# EAGLE design LightingBoard2 (EAGLE 8.5.2)
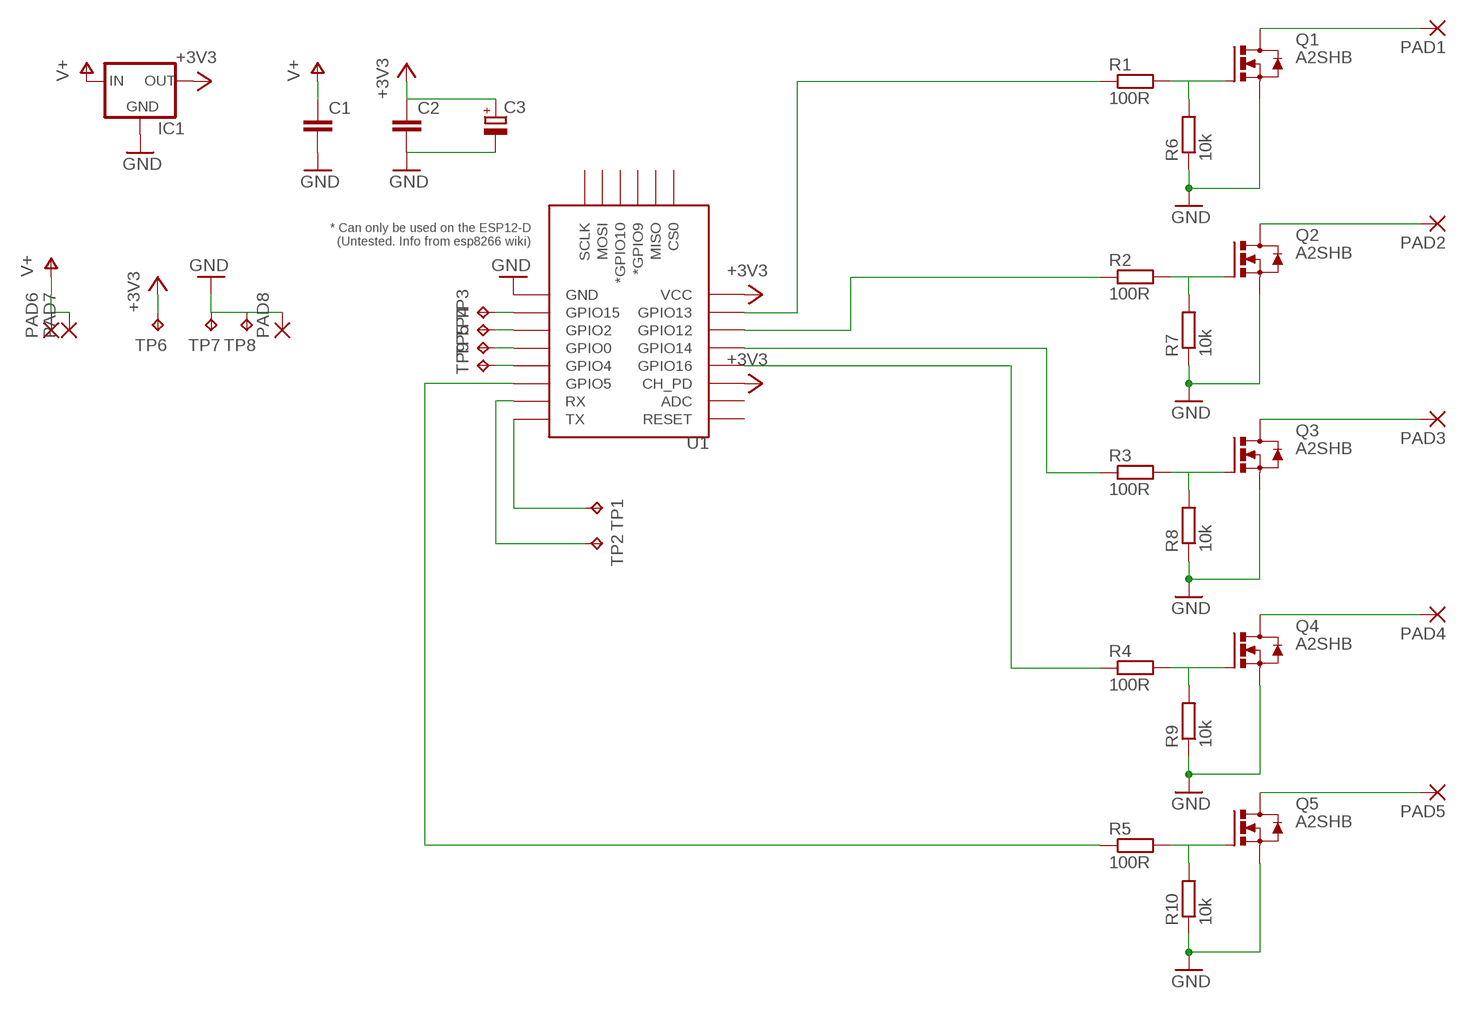
[diagram p0: schematic, sheet 1]

## Parts
C1  C-EUC0603  [C0603]
C2  C-EUC0603  [C0603]
C3  CPOL-EU153CLV-0505  [153CLV-0505]
IC1  LM1117  [SOT223]
PAD1  SMD5  [SMD2,54-5,08]
PAD2  SMD5  [SMD2,54-5,08]
PAD3  SMD5  [SMD2,54-5,08]
PAD4  SMD5  [SMD2,54-5,08]
PAD5  SMD5  [SMD2,54-5,08]
PAD6  SMD5  [SMD2,54-5,08]
PAD7  SMD5  [SMD2,54-5,08]
PAD8  SMD5  [SMD2,54-5,08]
Q1  A2SHB  MOSFET_N_SOT231  [SOT23]
Q2  A2SHB  MOSFET_N_SOT231  [SOT23]
Q3  A2SHB  MOSFET_N_SOT231  [SOT23]
Q4  A2SHB  MOSFET_N_SOT231  [SOT23]
Q5  A2SHB  MOSFET_N_SOT231  [SOT23]
R1  100R  R-EU_R0603  [R0603]
R2  100R  R-EU_R0603  [R0603]
R3  100R  R-EU_R0603  [R0603]
R4  100R  R-EU_R0603  [R0603]
R5  100R  R-EU_R0603  [R0603]
R6  10k  R-EU_R0603  [R0603]
R7  10k  R-EU_R0603  [R0603]
R8  10k  R-EU_R0603  [R0603]
R9  10k  R-EU_R0603  [R0603]
R10  10k  R-EU_R0603  [R0603]
TP1  TPTP18R  [TP18R]
TP2  TPTP18R  [TP18R]
TP3  TPTP12SQ  [TP12SQ]
TP4  TPTP12SQ  [TP12SQ]
TP5  TPTP12SQ  [TP12SQ]
TP6  TPTP12SQ  [TP12SQ]
TP7  TPTP12SQ  [TP12SQ]
TP8  TPTP12SQ  [TP12SQ]
TP9  TPTP12SQ  [TP12SQ]
U1  ESP12ESMD  [ESP12E-SMD]

## Nets
+3V3: C2.1 C3.+ IC1.2(OUT) TP6.TP U1.CH_PD U1.VCC
GND: C1.2 C2.2 C3.- IC1.1(GND) PAD8.1(P) Q1.2(S) Q2.2(S) Q3.2(S) Q4.2(S) Q5.2(S) R6.1 R7.1 R8.1 R9.1 R10.1 TP7.TP TP8.TP U1.GND
N$1: Q2.1(G) R2.2 R7.2
N$2: Q1.1(G) R1.2 R6.2
N$3: Q3.1(G) R3.2 R8.2
N$4: Q4.1(G) R4.2 R9.2
N$5: Q5.1(G) R5.2 R10.2
N$6: TP9.TP U1.GPIO4
N$11: R1.1 U1.GPIO13
N$12: R2.1 U1.GPIO12
N$13: R3.1 U1.GPIO14
N$14: R4.1 U1.GPIO16
N$15: R5.1 U1.GPIO5
N$16: PAD5.1(P) Q5.3(D)
N$17: PAD4.1(P) Q4.3(D)
N$18: PAD3.1(P) Q3.3(D)
N$19: PAD2.1(P) Q2.3(D)
N$20: PAD1.1(P) Q1.3(D)
N$21: TP1.TP U1.TXD0(TX)
N$22: TP2.TP U1.RXD0(RX)
N$23: TP3.TP U1.GPIO15
N$24: TP4.TP U1.GPIO2
N$25: TP5.TP U1.GPIO0
V+: C1.1 IC1.3(IN) PAD6.1(P) PAD7.1(P)
Unconnected: U1.ADC U1.CS0 U1.GPIO9(*GPIO9) U1.GPIO10(*GPIO10) U1.MISO U1.MOSI U1.RESET U1.SCLK

## Library data of the parts
C1 C2 = resistor:C-EU: CAPACITOR, European symbol
C3 = resistor:CPOL-EU: POLARIZED CAPACITOR, European symbol
IC1 = v-reg-2:LM1117
PAD1-PAD8 = wirepad:SMD5: SMD PAD
Q1-Q5 = m-pad-2.1:MOSFET_N_SOT23: n channel mosfets in the sot-23 package standard pinout ie. fairchildsemi.com: FDN327N FDN335N FDN337N FDN372S NDS355AN etc. ie fairchild at digikey: FDV303N NDS351N NDS355N etc.
R1-R10 = resistor:R-EU_: RESISTOR, European symbol
TP1-TP9 = testpad:TP: Test pad
U1 = esp8266modules:ESP12E: ESP12E Module

## Board
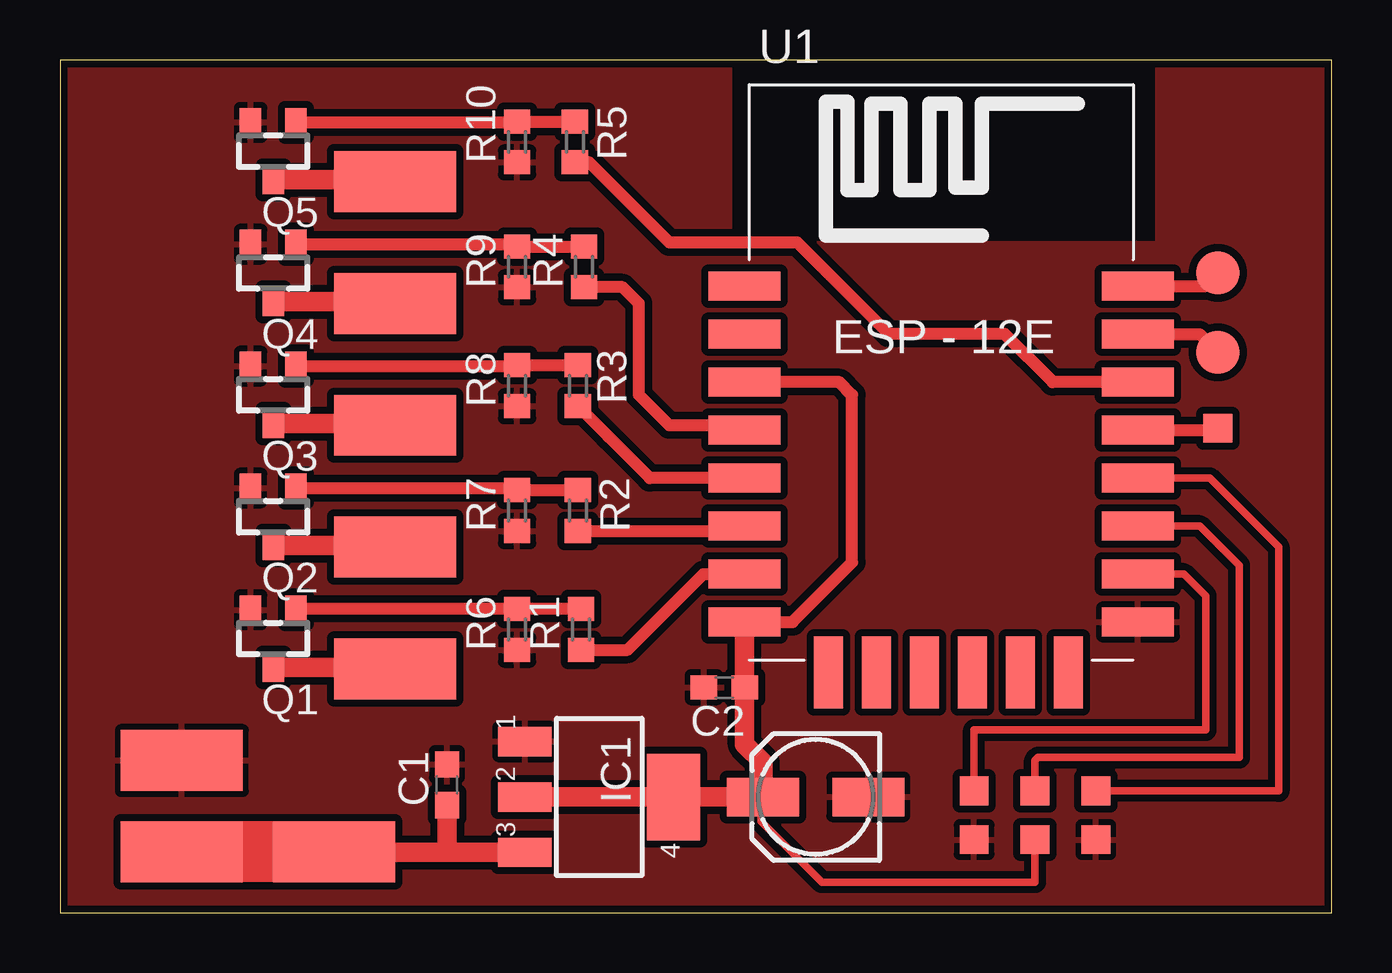
[diagram p1: board, top side]

Size 53.01 x 35.55 mm. Coordinates in mm from the lower left corner, seen from the top.
Outline: 0,0 53.01,0 53.01,35.55 0,35.55 0,0
Copper layers (1*16): Top 0.035mm / dielectric 1.5mm / Bottom 0.035mm
Design rules "SeeedStudio_2layer_DRU_no_angle_20140221 *": minimum track width 6mil, minimum drill 12mil, track to track 12mil, track to pad 12mil, pad to pad 12mil, via to via 6mil, smd to smd 0mil, copper to edge 12mil, drill to drill 10mil, minimum pad ring 10mil, minimum via ring 6mil, stop-mask expansion 2mil, vias tented up to drill 100mil, thermal gap 10mil

### Footprints (pad centres in the part's own frame; a part is rotated, then mirrored left to right if it is on the bottom)
C0603 = smd 1.1 x 1: 1 -0.85,0; 2 0.85,0
153CLV-0505 = smd 3 x 1.6: + 2.2,0; - -2.2,0
SOT223 = smd 1.219 x 2.235: 1 -2.311,-3.099; 2 0,-3.099; 3 2.311,-3.099 | smd 3.6 x 2.2: 4 0,3.099
SMD2,54-5,08 = smd 2.54 x 5.08: 1 0,0
SOT23 = smd 0.9 x 1.2: 1 -0.95,-1.2; 2 0.95,-1.2; 3 0,1.2
R0603 = smd 1 x 1.1: 1 -0.85,0; 2 0.85,0
TP18R = smd 1.8 x 1.8: TP 0,0
TP12SQ = smd 1.2 x 1.2: TP 0,0
ESP12E-SMD = smd 3 x 1.2: ADC -8.3,3.8; CH_PD -8.3,1.8; GND 8.1,-8.2; GPIO0 8.1,-2.2; GPIO2 8.1,-4.2; GPIO4 8.1,-0.2; GPIO5 8.1,1.8; GPIO12 -8.3,-4.2; GPIO13 -8.3,-6.2; GPIO14 -8.3,-2.2; GPIO15 8.1,-6.2; GPIO16 -8.3,-0.2; RESET -8.3,5.8; RXD0 8.1,3.8; TXD0 8.1,5.8; VCC -8.3,-8.2 | smd 1.2 x 3: CS0 -4.8,-10.3; GPIO9 -0.8,-10.3; GPIO10 1.2,-10.3; MISO -2.8,-10.3; MOSI 3.2,-10.3; SCLK 5.2,-10.3

### Placement (x,y rotation side)
C1  16.13,5.33 90 top
C2  27.69,9.4 180 top
C3  31.5,4.83 180 top
IC1  22.48,4.83 270 top
PAD1  13.97,10.16 90 top
PAD2  13.97,15.24 90 top
PAD3  13.97,20.32 90 top
PAD4  13.97,25.4 90 top
PAD5  13.97,30.48 90 top
PAD6  5.08,2.54 90 top
PAD7  11.43,2.54 90 top
PAD8  5.08,6.35 90 top
Q1  8.89,11.43 180 top
Q2  8.89,16.51 180 top
Q3  8.89,21.59 180 top
Q4  8.89,26.67 180 top
Q5  8.89,31.75 180 top
R1  21.72,11.81 90 top
R2  21.59,16.76 90 top
R3  21.59,21.97 90 top
R4  21.84,26.92 90 top
R5  21.46,32.13 90 top
R6  19.05,11.81 90 top
R7  19.05,16.76 90 top
R8  19.05,21.97 90 top
R9  19.05,26.92 90 top
R10  19.05,32.13 90 top
TP1  48.26,26.67 0 top
TP2  48.26,23.37 0 top
TP3  38.1,5.08 0 top
TP4  40.64,5.08 0 top
TP5  43.18,5.08 0 top
TP6  40.64,3.05 0 top
TP7  43.18,3.05 0 top
TP8  38.1,3.05 0 top
TP9  48.26,20.19 0 top
U1  36.83,20.32 0 top

### Tracks (layer width: path | path; a pad name or v marks a point on that pad's centre or on a via)
+3V3
  Top 0.305: TP6.TP 40.64,1.27 31.75,1.27 29.21,3.81 29.21,4.83
  Top 0.508: U1.VCC 30.54,12.12 33.02,14.61 33.02,21.59 32.49,22.12 U1.CH_PD
  Top 0.813: IC1.2 29.21,4.83 C3.+ 29.3,6.26 28.54,7.02 C2.1 U1.VCC
GND
  pour Top: 0,35.56 27.94,35.56 27.94,27.94 45.72,27.94 45.72,35.56 53.34,35.56 53.34,0 0,0
N$1
  Top 0.508: Q2.1 18.95,17.71 R7.2 R2.2
N$2
  Top 0.508: R1.2 R6.2 9.87,12.66 Q1.1
N$3
  Top 0.508: Q3.1 19.02,22.79 R8.2 R3.2
N$4
  Top 0.508: Q4.1 18.95,27.87 R9.2 R4.2
N$5
  Top 0.508: Q5.1 19.02,32.95 R10.2 R5.2
N$6
  Top 0.508: U1.GPIO4 48.19,20.12 TP9.TP
N$11
  Top 0.508: R1.1 23.66,10.96 26.82,14.12 U1.GPIO13
N$12
  Top 0.508: R2.1 28.32,15.91 U1.GPIO12
N$13
  Top 0.508: R3.1 22.62,20.09 22.86,19.85 24.59,18.12 U1.GPIO14
N$14
  Top 0.508: U1.GPIO16 28.33,20.32 25.4,20.32 24.13,21.59 24.13,25.4 23.46,26.07 R4.1
N$15
  Top 0.508: R5.1 22.06,31.28 25.4,27.94 30.73,27.94 34.54,24.13 39.37,24.13 41.38,22.12 U1.GPIO5
N$16
  Top 0.508: 13.9,30.55 PAD5.1
  Top 0.813: Q5.3 13.9,30.55
N$17
  Top 0.508: 13.9,25.47 PAD4.1
  Top 0.813: Q4.3 13.9,25.47
N$18
  Top 0.508: 13.9,20.39 PAD3.1
  Top 0.813: Q3.3 13.9,20.39
N$19
  Top 0.508: 13.9,15.31 PAD2.1
  Top 0.813: Q2.3 13.9,15.31
N$20
  Top 0.508: 13.9,10.23 PAD1.1
  Top 0.813: Q1.3 13.9,10.23
N$21
  Top 0.508: U1.TXD0 47.71,26.12 TP1.TP
N$22
  Top 0.508: U1.RXD0 47.51,24.12 TP2.TP
N$23
  Top 0.305: TP3.TP 38.1,7.62 47.75,7.62 47.75,13.21 46.84,14.12 U1.GPIO15
N$24
  Top 0.305: TP4.TP 40.64,6.35 40.77,6.48 49.15,6.48 49.15,14.48 47.51,16.12 U1.GPIO2
N$25
  Top 0.305: U1.GPIO0 47.92,18.12 50.8,15.24 50.8,5.08 TP5.TP
V+
  Top 0.813: PAD7.1 13.99,2.52 16,2.52 | 16,2.52 IC1.3 | C1.1 16.13,2.64 16,2.52
  Top 2.54: PAD7.1 PAD6.1